# Altium schematic sheet energy-monitor.SchDoc
size Letter; SheetNumber: 3
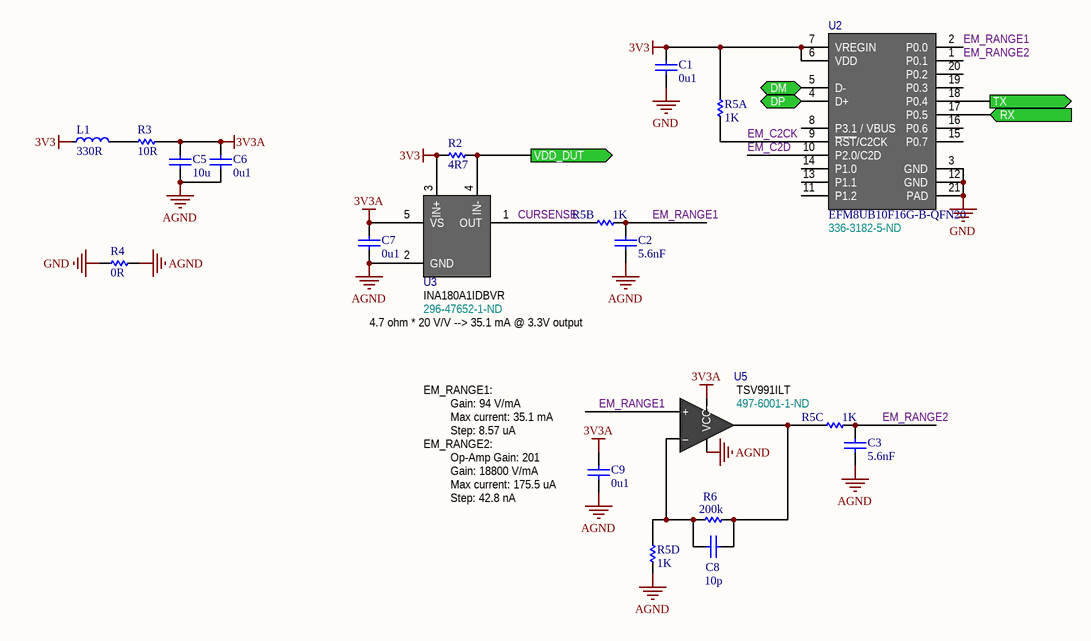
[diagram p0: energy-monitor.SchDoc]

## Parts
C1  0u1  [CAPC1005N]
C2  5.6nF  [CAPC1005N]
C3  5.6nF  [CAPC1005N]
C5  10u  [CAPC1608N]
C6  0u1  [CAPC1005N]
C7  0u1  [CAPC1005N]
C8  10p  [CAPC1005N]
C9  0u1  [CAPC1005N]
L1  value 330R  [INDC1005N]  (hidden comment: Inductor)
R2  4R7  [RESC1608N]
R3  10R  [RESC1005N]
R4  0R  [RESC1005N]
R5  value 1K  [RESNET_8_1206]  (hidden comment: Res Pack5)  (parts A,B,C,D of 4)
R6  200k  [RESC1005N]
U2  EFM8UB10F16G-B-QFN20  Supplier Part Number 1: 336-3182-5-ND  [QFN50P300X300X90-20N]
U3  INA180A1IDBVR  Supplier Part Number 1: 296-47652-1-ND  [SOT23-5AN]
U5  TSV991ILT  Supplier Part Number 1: 497-6001-1-ND  [SOT23-5AN]

## Ports
DM (bidir), DP (bidir), RX (in), TX (out), VDD_DUT (out)

## Nets
3V3: C1.2 L1.1 R2.1 R5.8 U2.6(VDD) U2.7(VREGIN) U3.3(IN+)
3V3A: C5.2 C6.2 C7.2 C9.2 R3.2 U3.5(VS) U5.5(VCC+)
AGND: C2.1 C3.1 C5.1 C6.1 C7.1 C9.1 R4.2 R5.5 U3.2(GND) U5.2(VCC-)
GND: C1.1 R4.1 U2.3(GND) U2.12(GND) U2.21(PAD)
CURSENSE: R5.7 U3.1(OUT)
DM: U2.5(D-) ; port DM
DP: U2.4(D+) ; port DP
EM_C2CK: R5.1 U2.9(~{RST}/C2CK)
EM_C2D: U2.10(P2.0/C2D)
EM_RANGE1: C2.2 R5.2 U2.2(P0.0) U5.3(+)
EM_RANGE2: C3.2 R5.3 U2.1(P0.1)
RX: U2.17(P0.5) ; port RX
TX: U2.18(P0.4) ; port TX
VDD_DUT: R2.2 U3.4(IN-) ; port VDD_DUT
NetC8_1: C8.1 R5.4 R6.1 U5.4(–)
NetC8_2: C8.2 R5.6 R6.2 U5.1(OUT)
NetL1_2: L1.2 R3.1

Not connected (* = marked no-connect by the designer): U2 8(P3.1_/_VBUS) 11(P1.2) 13(P1.1) 14(P1.0) 15(P0.7) 16(P0.6) 19(P0.3) 20(P0.2)

## Notes on the sheet
- 4.7 ohm * 20 V/V --> 35.1 mA @ 3.3V output
- EM_RANGE1:
- (near C9) Max current: 35.1 mA
- Gain: 94 V/mA
- Step: 8.57 uA
- EM_RANGE2:
- (near C9) Op-Amp Gain: 201
- (near C9) Gain: 18800 V/mA
- (near C9) Max current: 175.5 uA
- Step: 42.8 nA

## Library data of the parts
C1-C3 C5-C9 = Cap Semi: Capacitor (Semiconductor SIM Model); Published: 8-Jun-2000; LatestRevisionDate: 29-May-2009; LatestRevisionNote: IPC-7351 Footprint Added.; PackageReference: C1206; Publisher: Altium Limited; PackageDescription: Chip Capacitor
L1 = Inductor: Code_IEC: 1005; Published: 8-Jun-2000; LatestRevisionDate: 29-May-2009; LatestRevisionNote: IPC-7351 Footprint Added.; PackageReference: 0402-A; Publisher: Altium Limited; PackageDescription: Chip Inductor; Code_JEITA: 0402
R2-R4 R6 = Res Semi: Semiconductor Resistor; Published: 8-Jun-2000; LatestRevisionDate: 17-Jul-2002; LatestRevisionNote: Re-released for DXP Platform.; PackageReference: AXIAL-0.5; Publisher: Altium Limited; PackageDescription: Axial Device, Thru-Hole; 2 Leads; 0.5 in Pin Spacing
R5 = Res Pack5: Isolated Resistor Network - Parts; Sim Note: Enter the Resistance value into parameter field.; Published: 24-Mar-1999; LatestRevisionDate: 29-May-2009; LatestRevisionNote: IPC-7351 Footprint Added.; PackageReference: SOIC16; Publisher: Altium Limited; PackageDescription: 16-Pin Small Outline Integrated Circuit 1.27 mm Pitch; Code_JEDEC: MS-012-AC; Code_IPC: SOIC127P600-16
U2 = EFM8UB10F16G-B-QFN20: IC MCU 16KB 20QFN; Manufacturer: Silicon Labs; Core Size: 8-Bit; Speed: 50MHz; Connectivity: I²C, SMBus, SPI, UART/USART, USB; Peripherals: Brown-out Detect/Reset, POR, PWM, WDT; Number of I/O: 13; Program Memory Size: 16KB (16K x 8); Program Memory Type: FLASH; RAM Size: 2.25K x 8; Voltage - Supply (Vcc/Vdd): 2.2 V ~ 5.25 V; Data Converters: A/D 11x12b; Oscillator Type: Internal; Supplier 1: Digi-Key; Manufacturer Part Number: EFM8UB10F16G-B-QFN20; RoHS: RoHS Compliant; Category: Integrated Circuits (ICs); Stock 1: 75; Pricing 1: 1=1.18, 25=1.0832, 100=0.9848, 1000=0.88628 (USD); Packaging: Tube; Core Processor: CIP-51 8051; EEPROM Size: -; Operating Temperature: -40°C ~ 85°C; Package / Case: 20-UFQFN Exposed Pad; Supplier Device Package: 20-QFN (3x3); ComponentLink1URL: http://www.silabs.com/Support%20Documents/TechnicalDocs/EFM8UB1_DataSheet.pdf; ComponentLink1Description: http://www.silabs.com/Support%20Documents/TechnicalDocs/EFM8UB1_DataSheet.pdf
U3 = INA180A1IDBVR: Manufacturer: Texas Instruments; Amplifier Type: Current Sense; Output Type: Rail-to-Rail; Slew Rate: 2 V/µs; Current - Supply: 260µA; Voltage - Supply, Single/Dual (±): 2.7 V ~ 5.5 V; Supplier 1: Digi-Key; Manufacturer Part Number: INA180A1IDBVR; RoHS: RoHS Compliant; Category: Integrated Circuits (ICs); Stock 1: 1952; Pricing 1: 1=0.6, 10=0.51, 100=0.3807, 500=0.29912, 1000=0.23113 (USD); Packaging: Cut Tape (CT); Part Status: Active; Operating Temperature: -40°C ~ 125°C; Mounting Type: Surface Mount; Package / Case: SC-74A, SOT-753; Supplier Device Package: SOT-23-5; ComponentLink1URL: http://www.ti.com/lit/ds/symlink/ina180.pdf; ComponentLink1Description: http://www.ti.com/lit/ds/symlink/ina180.pdf
U5 = TSV991ILT: IC OPAMP GP 20MHZ RRO SOT23-5; Manufacturer: STMicroelectronics; Amplifier Type: General Purpose; Output Type: Rail-to-Rail; Slew Rate: 10 V/µs; Current - Supply: 820µA; Voltage - Supply, Single/Dual (±): 2.5 V ~ 5.5 V; Supplier 1: Digi-Key; Manufacturer Part Number: TSV991ILT; RoHS: RoHS Compliant; Category: Integrated Circuits (ICs); Stock 1: 2760; Pricing 1: 1=0.76, 10=0.673, 100=0.516, 500=0.40788, 1000=0.3263 (USD); Packaging: Cut Tape (CT); Part Status: Active; Operating Temperature: -40°C ~ 125°C; Mounting Type: Surface Mount; Package / Case: SC-74A, SOT-753; Supplier Device Package: SOT-23-5; Base Part Number: TSV991; ComponentLink1URL: http://www.st.com/content/ccc/resource/technical/document/datasheet/d8/e3/a5/aa/8f/d7/42/67/CD00144611.pdf/files/CD00144611.pdf/jcr:content/translations/en.CD00144611.pdf; ComponentLink1Description: http://www.st.com/content/ccc/resource/technical/document/datasheet/d8/e3/a5/aa/8f/d7/42/67/CD00144611.pdf/files/CD00144611.pdf/jcr:content/translations/en.CD00144611.pdf